# Altium schematic sheet 1_P1.schdoc
size 307 x 218 mm; Symbol: Drawing-Symbol_A4; Device: Drawing-Symbol_A4; @Project Name: Example Project; @Page Count: 1; @Update Date: 2025-08-05; @Create Date: 2025-08-04; @Schematic Name: Schematic1; @Page No: 1; @Page Name: P1; Company: EasyEDA.com; Version: V1.0; Page Size: A4; @Create Time: 15:54:22; @Update Time: 00:39:41; Width: 1170; Height: 825; Region Start: 1; X Region Count: 6; Y Region Count: 4; Blade Width: 10; Title Block Position: 3; @Board Name: Board1
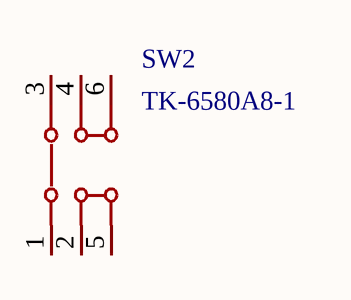
[diagram p0: 1_P1.schdoc]

## Parts
SW2  TK-6580A8-1  [SW-TH_TK-6580A8-1]

## Nets

Not connected (* = marked no-connect by the designer): SW2 1 2 3 4 5 6

## Notes on the sheet
- 1
- 2
- 3
- 4
- 5
- 6
- A
- B
- C
- Schematic
- Schematic1
- Create at
- Update at
- 2025-08-04
- 2025-08-05
- Board
- Drawn
- Board1
- Page
- P1
- D
- Reviewed
- Version
- Size
- Example Project
- Page  1  Total  1
- V1.0
- A4
- EasyEDA.com

## Library data of the parts
SW2 = TK-6580A8-1: Manufacturer: Yuandi(元迪); Add into BOM: yes; Circuit: DPDT; Self Lock / No Lock: LATCHING; Actuator Style: Square Plunger; Actuator/Cap Color: White; Pin Style: PCPin; Operating Force: 250gf; Symbol: TK-6580A8-1; Device: TK-6580A8-1; LCSC Part Name: 自锁开关5.8*5.8*7.3有声有锁插件六脚DIP按键开关带锁6P脚; Supplier Part: C528772; Manufacturer Part: TK-6580A8-1; Supplier Footprint: 插件; Datasheet: https://atta.szlcsc.com/upload/public/pdf/source/20200831/C528772_4B510A9DEFEA72083B4671ECF0F71BAC.pdf; Supplier: LCSC; Convert to PCB: yes; Mounting Style: Lying; Mechanical Life: -